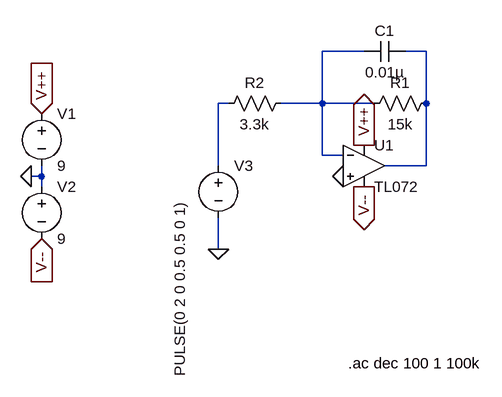
[diagram p0: schematic LowPassFirstOrder.asc]
LowPassFirstOrder.asc, the LTspice schematic file:
Version 4
SHEET 1 880 680
WIRE 608 80 544 80
WIRE 704 80 672 80
WIRE 400 160 384 160
WIRE 544 160 544 80
WIRE 544 160 480 160
WIRE 624 160 544 160
WIRE 704 160 704 80
WIRE 544 240 544 160
WIRE 576 240 544 240
WIRE 384 256 384 160
WIRE 704 256 704 160
WIRE 704 256 640 256
WIRE 112 272 112 256
WIRE 112 272 96 272
WIRE 112 288 112 272
WIRE 384 384 384 336
FLAG 96 272 0
FLAG 112 176 V++
IOPIN 112 176 In
FLAG 112 368 V--
IOPIN 112 368 In
FLAG 384 384 0
FLAG 608 288 V--
IOPIN 608 288 Out
FLAG 608 224 V++
IOPIN 608 224 Out
FLAG 576 272 0
SYMBOL Voltage 112 160 R0
SYMATTR InstName V1
SYMATTR Value 9
SYMBOL Voltage 112 272 R0
SYMATTR InstName V2
SYMATTR Value 9
SYMBOL Voltage 384 240 R0
WINDOW 3 -59 70 VRight 2
SYMATTR Value PULSE(0 2 0 0.5 0.5 0 1)
SYMATTR InstName V3
SYMATTR Value2 AC 1
SYMBOL OpAmps/TL072 608 192 R0
SYMATTR InstName U1
SYMBOL Res 720 144 R90
WINDOW 0 0 56 VBottom 2
WINDOW 3 32 56 VTop 2
SYMATTR InstName R1
SYMATTR Value 15k
SYMBOL Res 496 144 R90
WINDOW 0 0 56 VBottom 2
WINDOW 3 32 56 VTop 2
SYMATTR InstName R2
SYMATTR Value 3.3k
SYMBOL Cap 672 64 R90
WINDOW 0 0 32 VBottom 2
WINDOW 3 32 32 VTop 2
SYMATTR InstName C1
SYMATTR Value 0.01µ
TEXT 584 560 Left 2 !.ac dec 100 1 100k

The netlist it stands for:
* LowPassFirstOrder.asc
V1 V++ 0 9
V2 0 V-- 9
V3 N003 0 PULSE(0 2 0 0.5 0.5 0 1) AC 1
XU1 0 N001 V++ V-- N002 TL072  ; pins In+ In- V+ V- OUT
R1 N002 N001 15k
R2 N001 N003 3.3k
C1 N002 N001 0.01µ
.ac dec 100 1 100k
.backanno
.end